# EAGLE design Mandala (EAGLE 6.5.0)
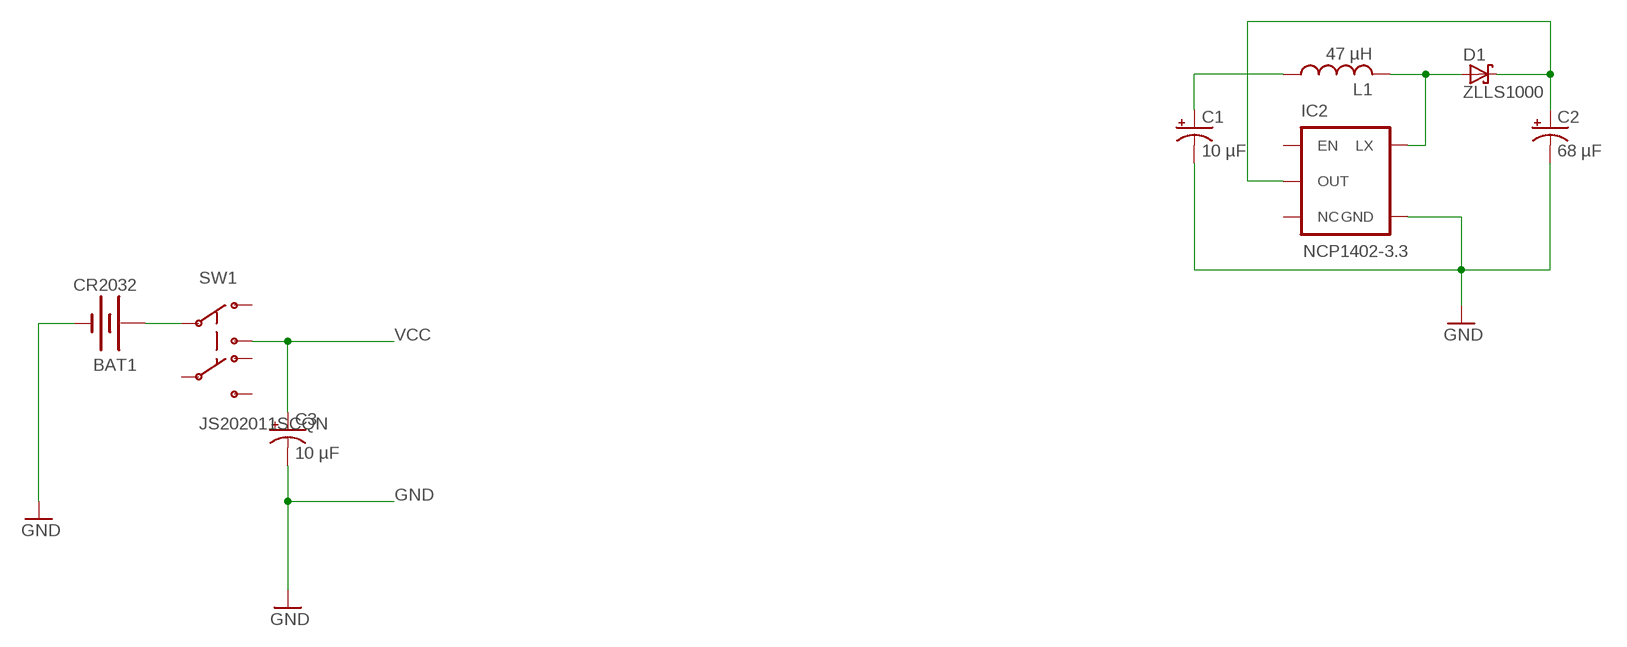
[diagram p0: schematic, sheet 1]

## Parts
BAT1  CR2032  BATTERY20SMD-RIGHT  [BATTCON_20MM]
C1  10 µF  CPOL-USSMCB  [SMC_B]
C2  68 µF  CPOL-USSMCB  [SMC_B]
C3  10 µF  CPOL-USSMCB  [SMC_B]
D1  ZLLS1000  BAS40  [SOT23]
IC2  NCP1402-3.3  V_REG_NCP1400SOT23-5  [SOT23-5]
L1  47 µH  PANASONIC_ELL5PS  [ELL5PS_INDUCTOR]
SW1  JS202011SCQN  SW_DPDT_JS202011SCQN  [JS202011SCQN_DPDT]

## Nets
GND: BAT1.2(-) C1.- C2.- C3.- IC2.4(GND)
N$2: D1.1(A) IC2.5(LX) L1.P$2
N$16: BAT1.3(+) SW1.P$2
VCC: C1.+ C3.+ L1.P$1 SW1.P$3
VLED: C2.+ D1.3(C) IC2.2(OUT)
Unconnected: IC2.1(EN) IC2.3(NC) SW1.P$1 SW1.P$4 SW1.P$5 SW1.P$6

## Library data of the parts
BAT1 = SparkFun:BATTERY: Battery Holders Various common sizes : AA, AAA, 20mm coin cell and 12mm coin cell.
C1-C3 = rcl:CPOL-US: POLARIZED CAPACITOR, American symbol
D1 = diode:BAS40: Silicon Schottky Diodes General-purpose diode for high-speed switching
IC2 = SparkFun:V_REG_NCP1400: Switching step-up voltage regulator NCP1400 switiching regulator takes single cell AA and outputs 100mA at 3.3V or 5V with minimal number of external components.
L1 = jenwilly_custom:PANASONIC_ELL5PS: Panasonic ELL5PS SMD inductor
SW1 = jenwilly_custom:SW_DPDT_JS202011SCQN: DPDT SMD Switch C&K JS202011SCQN sub-miniature slide switch Contact rating: 6VDC @ 0.3A - 30VDC @ 0.1A Datasheet <http://www.ck-components.com/index.php?module=media&action=Display&cmpref=14398&lang=en&width=&height=&format=&alt=> Digi-Key no: 401-2002-1-ND

## Board
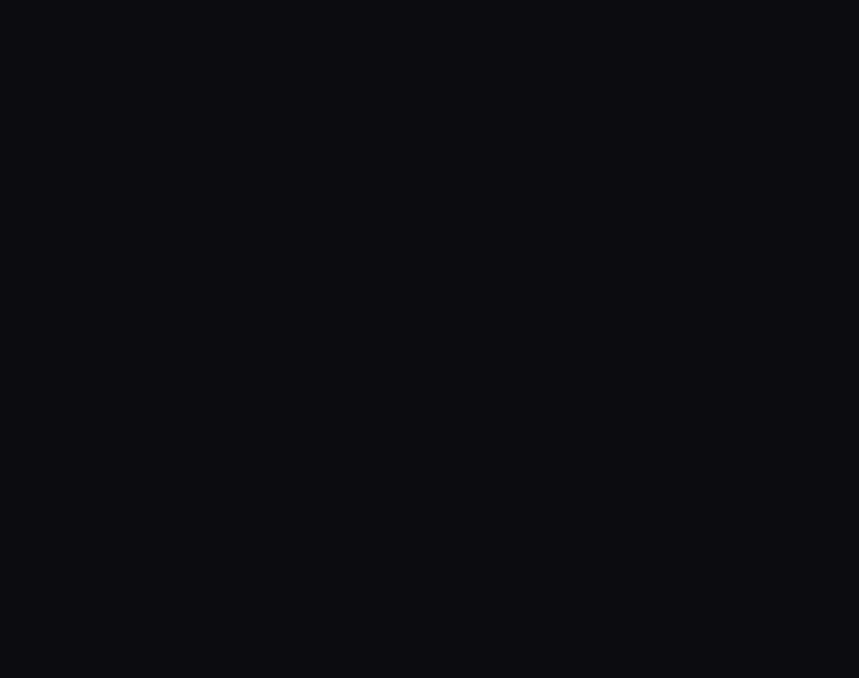
[diagram p1: board, top side]
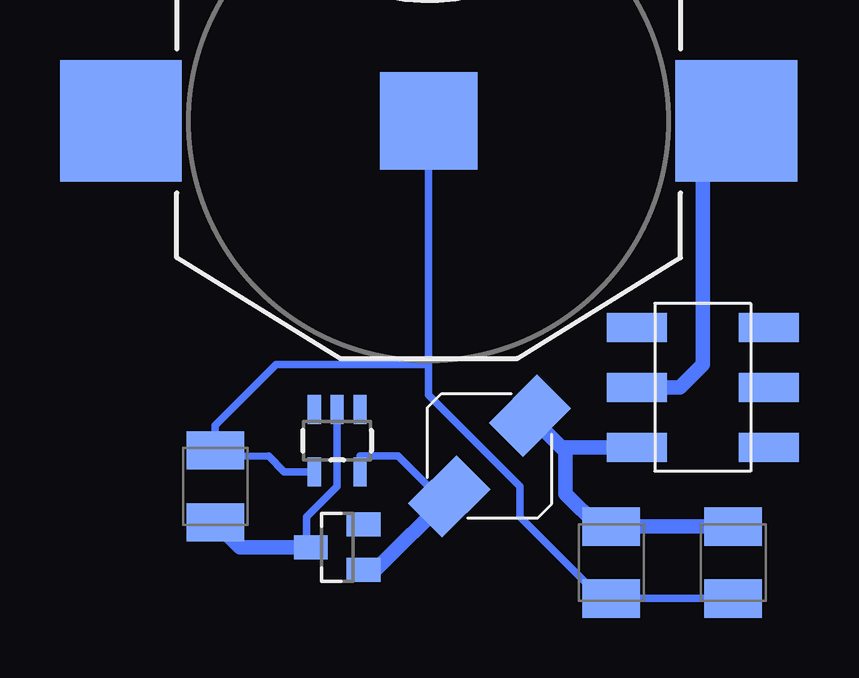
[diagram p2: board, bottom side, seen from below]

No outline drawn. Coordinates in mm, seen from the top.
Copper layers (1*16): Top 0.035mm / dielectric 1.5mm / Bottom 0.035mm
Design rules "default": minimum track width 10mil, minimum drill 24mil, track to track 8mil, track to pad 8mil, pad to pad 8mil, via to via 8mil, smd to smd 8mil, copper to edge 40mil, drill to drill 8mil, minimum pad ring 10mil, minimum via ring 8mil, stop-mask expansion 4mil, vias tented up to drill 0mil, thermal gap 10mil

### Footprints (pad centres in the part's own frame; a part is rotated, then mirrored left to right if it is on the bottom)
BATTCON_20MM = smd 5.08 x 5.08: 1 -12.827,0; 3 12.827,0 | smd 4.064 x 4.064: 2 0,0
SMC_B = smd 1.6 x 2.4: + -1.5,0; - 1.5,0
SOT23 = smd 1 x 1.4: 1 -0.95,-1.1; 2 0.95,-1.1; 3 0,1.1
SOT23-5 = smd 0.55 x 1.2: 1 -0.95,-1.3; 2 0,-1.3; 3 0.95,-1.3; 4 0.95,1.3; 5 -0.95,1.3
ELL5PS_INDUCTOR = smd 2.85 x 2 rotated 225: P$1 1.686,1.672; P$2 -1.672,-1.686
JS202011SCQN_DPDT = smd 1.2 x 2.5: P$1 -2.5,-2.75; P$2 0,-2.75; P$3 2.5,-2.75; P$4 2.5,2.75; P$5 0,2.75; P$6 -2.5,2.75

### Placement (x,y rotation side)
BAT1  24.45,25.72 0 bottom
C1  11.75,7.3 270 bottom
C2  33.34,10.48 90 bottom
C3  16.83,7.3 270 bottom
D1  28.26,7.94 90 bottom
IC2  28.26,12.38 180 bottom
L1  21.91,11.75 0 bottom
SW1  13.02,14.61 270 bottom

### Tracks (layer width: path | path; a pad name or v marks a point on that pad's centre or on a via)
GND
  Bottom 0.305: C1.- C3.- 17.87,6.44 20.64,9.21 20.64,10.48 24.45,14.29 24.45,15.56 | IC2.4 30.48,11.08 31.11,11.75 33.08,11.72 C2.- 33.34,13.02 30.8,15.56 24.45,15.56 | 24.45,15.56 BAT1.2
N$2
  Bottom 0.305: L1.P$2 24.03,10.06 25.72,11.75 27.3,11.75 IC2.5
  Bottom 0.61: D1.1 26.65,6.99 L1.P$2
N$16
  Bottom 0.61: BAT1.3 13.02,24.32 13.02,15.56 13.97,14.61 SW1.P$2
VCC
  Bottom 0.61: C1.+ C3.+ 17.38,8.8 18.73,10.16 18.73,11.93 18.91,12.11 | 18.91,12.11 SW1.P$3 | 18.91,12.11 L1.P$1
VLED
  Bottom 0.305: D1.3 29.53,8.11 29.53,9.21 28.26,10.48 IC2.2
  Bottom 0.61: D1.3 32.3,7.94 C2.+